# EAGLE design TPS65273V-Board (EAGLE 8.3.2)
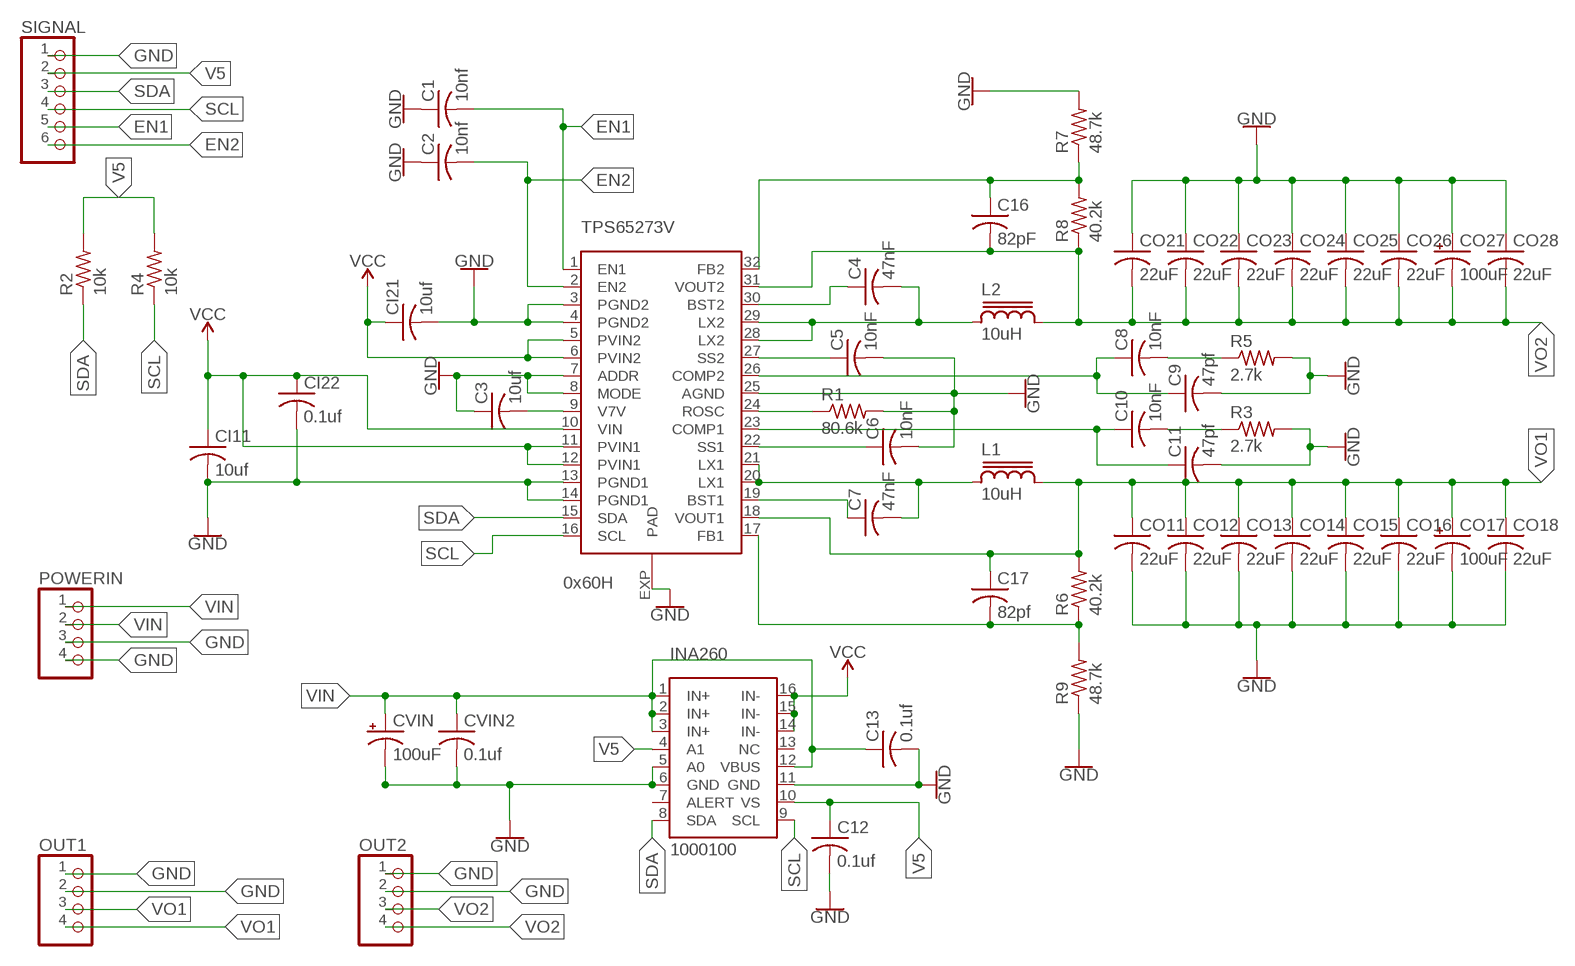
[diagram p0: schematic, sheet 1]

## Parts
C1  10nf  C-USC0805  [C0805]
C2  10nf  C-USC0805  [C0805]
C3  10uf  C-USC0805  [C0805]
C4  47nF  C-USC0805  [C0805]
C5  10nF  C-USC0805  [C0805]
C6  10nF  C-USC0805  [C0805]
C7  47nF  C-USC0805  [C0805]
C8  10nF  C-USC0805  [C0805]
C9  47pf  C-USC0805  [C0805]
C10  10nF  C-USC0805  [C0805]
C11  47pf  C-USC0805  [C0805]
C12  0.1uf  C-USC0805  [C0805]
C13  0.1uf  C-USC0805  [C0805]
C16  82pF  C-USC0805  [C0805]
C17  82pf  C-USC0805  [C0805]
CI11  10uf  C-USC1210  [C1210]
CI21  10uf  C-USC1210  [C1210]
CI22  0.1uf  C-USC0805  [C0805]
CO11  22uF  C-USC0805  [C0805]
CO12  22uF  C-USC0805  [C0805]
CO13  22uF  C-USC0805  [C0805]
CO14  22uF  C-USC0805  [C0805]
CO15  22uF  C-USC0805  [C0805]
CO16  22uF  C-USC0805  [C0805]
CO17  100uF  100UF-POLAR-25V-20%(ELEC)  [PANASONIC_D]
CO18  22uF  C-USC0805  [C0805]
CO21  22uF  C-USC0805  [C0805]
CO22  22uF  C-USC0805  [C0805]
CO23  22uF  C-USC0805  [C0805]
CO24  22uF  C-USC0805  [C0805]
CO25  22uF  C-USC0805  [C0805]
CO26  22uF  C-USC0805  [C0805]
CO27  100uF  100UF-POLAR-25V-20%(ELEC)  [PANASONIC_D]
CO28  22uF  C-USC0805  [C0805]
CVIN  100uF  100UF-POLAR-25V-20%(ELEC)  [PANASONIC_D]
CVIN2  0.1uf  C-USC0805  [C0805]
INA260  1000100  INA260  [TSSOP16]
L1  10uH  MSS1048  [MSS1048]
L2  10uH  MSS1048  [MSS1048]
OUT1  PINHD-1X4  [1X04]
OUT2  PINHD-1X4  [1X04]
POWERIN  PINHD-1X4  [1X04]
R1  80.6k  R-US_R0805  [R0805]
R2  10k  R-US_R0805  [R0805]
R3  2.7k  R-US_R0805  [R0805]
R4  10k  R-US_R0805  [R0805]
R5  2.7k  R-US_R0805  [R0805]
R6  40.2k  R-US_R0805  [R0805]
R7  48.7k  R-US_R0805  [R0805]
R8  40.2k  R-US_R0805  [R0805]
R9  48.7k  R-US_R0805  [R0805]
SIGNAL  PINHD-1X6  [1X06]
TPS65273V  0x60H  TPS65273V  [HTSSOP32DAP]

## Nets
EN1: C1.2 SIGNAL.5 TPS65273V.1(EN1)
EN2: C2.2 SIGNAL.6 TPS65273V.2(EN2)
FB1: C17.2 R6.1 R9.2 TPS65273V.17(FB1)
FB2: C16.1 R7.1 R8.2 TPS65273V.32(FB2)
GND: C1.1 C2.1 C3.1 C5.2 C6.2 C9.2 C11.2 C12.2 C13.2 CI11.2 CI21.2 CI22.2 CO11.2 CO12.2 CO13.2 CO14.2 CO15.2 CO16.2 CO17.- CO18.2 CO21.1 CO22.1 CO23.1 CO24.1 CO25.1 CO26.1 CO27.+ CO28.1 CVIN2.2 CVIN.- INA260.5(A0) INA260.6(GND) INA260.11(GND) OUT1.1 OUT1.2 OUT2.1 OUT2.2 POWERIN.3 POWERIN.4 R1.2 R3.2 R5.2 R7.2 R9.1 SIGNAL.1 TPS65273V.3(PGND2) TPS65273V.4(PGND2) TPS65273V.7(ADDR) TPS65273V.8(MODE) TPS65273V.13(PGND1) TPS65273V.14(PGND1) TPS65273V.25(AGND) TPS65273V.EXP(PAD)
N$1: C3.2 TPS65273V.9(V7V)
N$4: C4.2 L2.1 TPS65273V.28(LX2) TPS65273V.29(LX2)
N$5: C4.1 TPS65273V.30(BST2)
N$7: C10.1 C11.1 TPS65273V.23(COMP1)
N$8: R1.1 TPS65273V.24(ROSC)
N$9: C10.2 R3.1
N$10: C5.1 TPS65273V.27(SS2)
N$11: C8.1 C9.1 TPS65273V.26(COMP2)
N$12: C8.2 R5.1
N$13: C6.1 TPS65273V.22(SS1)
N$14: C7.2 L1.1 TPS65273V.20(LX1) TPS65273V.21(LX1)
N$16: C7.1 TPS65273V.19(BST1)
SCL: INA260.9(SCL) R4.1 SIGNAL.4 TPS65273V.16(SCL)
SDA: INA260.8(SDA) R2.1 SIGNAL.3 TPS65273V.15(SDA)
V5: C12.1 INA260.4(A1) INA260.10(VS) R2.2 R4.2 SIGNAL.2
VCC: CI11.1 CI21.1 CI22.1 INA260.14(IN-) INA260.15(IN-) INA260.16(IN-) TPS65273V.5(PVIN2) TPS65273V.6(PVIN2) TPS65273V.10(VIN) TPS65273V.11(PVIN1) TPS65273V.12(PVIN1)
VIN: C13.1 CVIN2.1 CVIN.+ INA260.1(IN+) INA260.2(IN+) INA260.3(IN+) INA260.12(VBUS) POWERIN.1 POWERIN.2
VO1: C17.1 CO11.1 CO12.1 CO13.1 CO14.1 CO15.1 CO16.1 CO17.+ CO18.1 L1.2 OUT1.3 OUT1.4 R6.2 TPS65273V.18(VOUT1)
VO2: C16.2 CO21.2 CO22.2 CO23.2 CO24.2 CO25.2 CO26.2 CO27.- CO28.2 L2.2 OUT2.3 OUT2.4 R8.1 TPS65273V.31(VOUT2)
Unconnected: INA260.7(ALERT) INA260.13(NC)

## Library data of the parts
C1-C13 C16 C17 CI11 CI21 CI22 CO11-CO16 CO18 CO21-CO26 CO28 CVIN2 = adafruit:C-US: CAPACITOR, American symbol
CO17 CO27 CVIN = SparkFun-Capacitors:100UF-POLAR: 100µF polarized capacitors A capacitor is a passive two-terminal electrical component used to store electrical energy temporarily in an electric field.; PROD_ID: CAP-12547
INA260 = IC-packages_BIG-pack V1.0:INA260
L1 L2 = inductor-coilcraft:MSS1048: SMT Power Inductor
OUT1 OUT2 POWERIN = pinhead:PINHD-1X4: PIN HEADER
R1-R9 = adafruit:R-US_: RESISTOR, American symbol
SIGNAL = pinhead:PINHD-1X6: PIN HEADER
TPS65273V = IC-packages_BIG-pack V1.0:TPS65273V

## Board
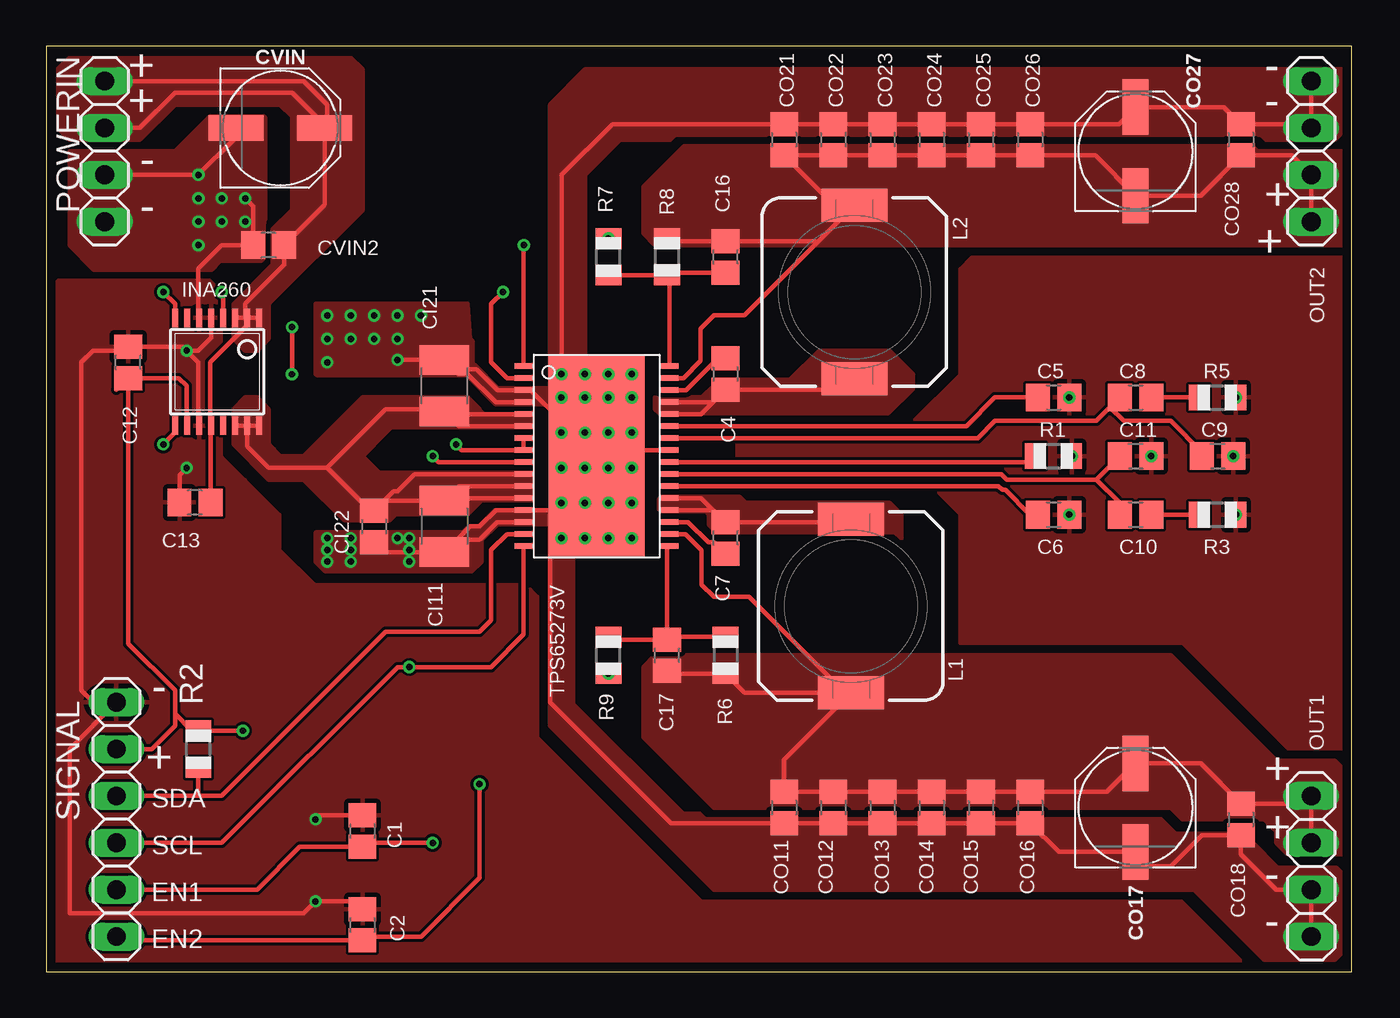
[diagram p1: board, top side]
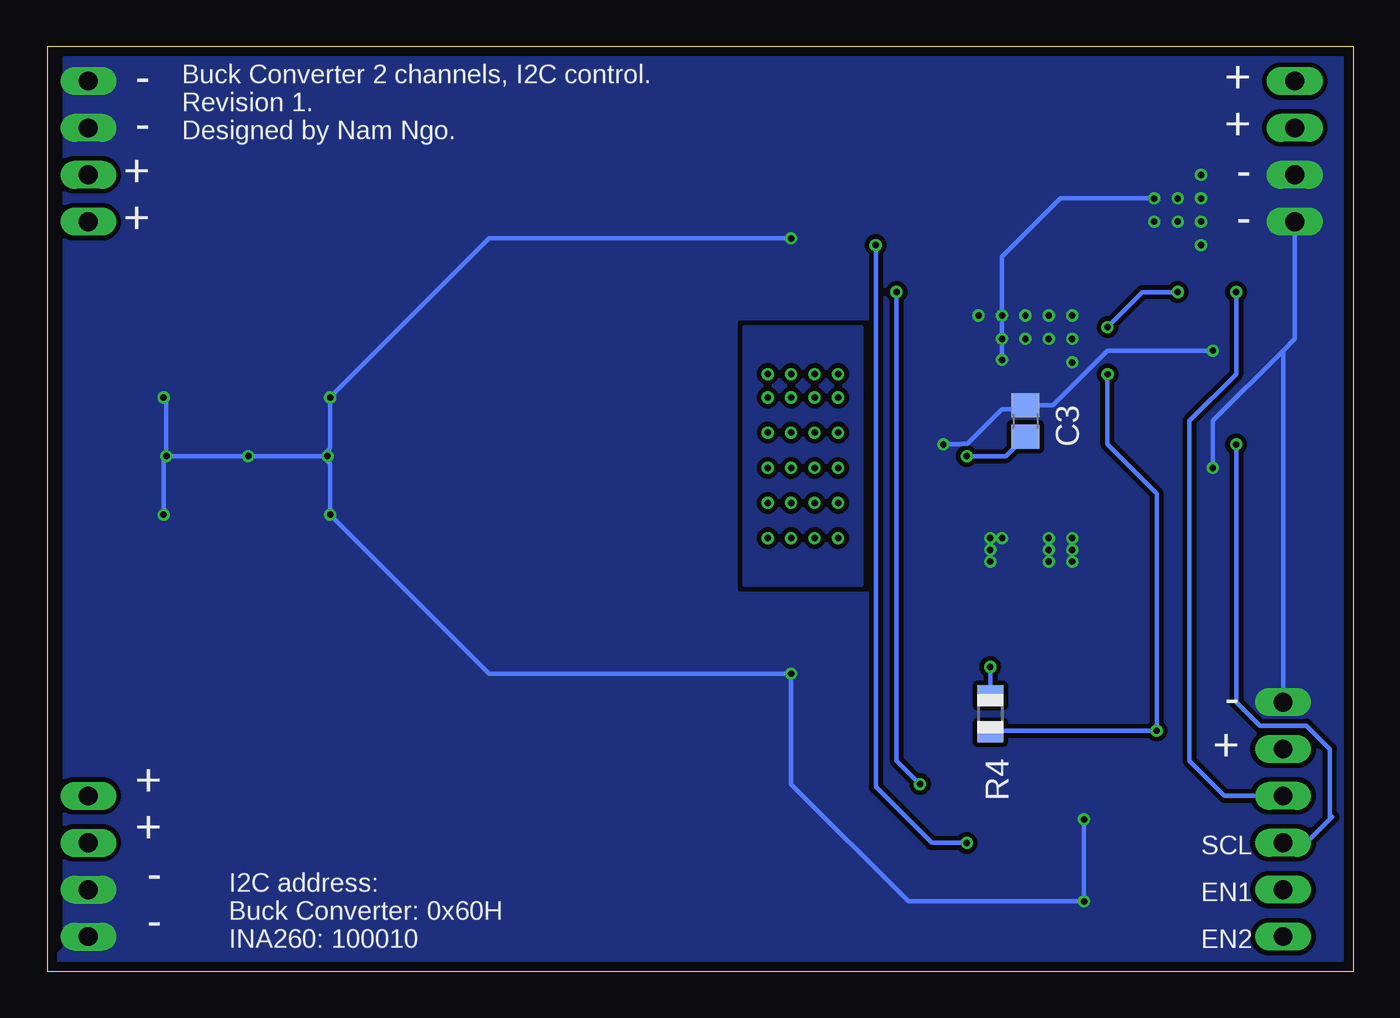
[diagram p2: board, bottom side, seen from below]

Size 70.79 x 50.16 mm. Coordinates in mm from the lower left corner, seen from the top.
Outline: 0,0 70.79,0 70.79,50.16 0,50.16 0,0
Copper layers (1*16): Top 0.035mm / dielectric 1.6mm / Bottom 0.035mm
Design rules "Elecrow_2-layer_PCB_eagle_rule": minimum track width 6mil, minimum drill 12mil, track to track 6mil, track to pad 6mil, pad to pad 6mil, via to via 8mil, smd to smd 0mil, copper to edge 20mil, drill to drill 10mil, minimum pad ring 6mil, minimum via ring 6mil, stop-mask expansion 0mil, vias tented up to drill 100mil, thermal gap 10mil

### Footprints (pad centres in the part's own frame; a part is rotated, then mirrored left to right if it is on the bottom)
C0805 = smd 1.3 x 1.5: 1 -0.85,0; 2 0.85,0
C1210 = smd 1.6 x 2.7: 1 -1.4,0; 2 1.4,0
PANASONIC_D = smd 3 x 1.4: + 2.4,0; - -2.4,0
TSSOP16 = smd 0.305 x 0.991: 1 -2.275,-2.918; 2 -1.625,-2.918; 3 -0.975,-2.918; 4 -0.325,-2.918; 5 0.325,-2.918; 6 0.975,-2.918; 7 1.625,-2.918; 8 2.275,-2.918; 9 2.275,2.918; 10 1.625,2.918; 11 0.975,2.918; 12 0.325,2.918; 13 -0.325,2.918; 14 -0.975,2.918; 15 -1.625,2.918; 16 -2.275,2.918
MSS1048 = smd 3.56 x 1.78: 1 0,4.7; 2 0,-4.7
1X04 = drill 1.016 long: 1 -3.81,0; 2 -1.27,0; 3 1.27,0; 4 3.81,0
R0805 = smd 1.1 x 1.4: 1 -1,0; 2 1,0
1X06 = drill 1.016 long: 1 -6.35,0; 2 -3.81,0; 3 -1.27,0; 4 1.27,0; 5 3.81,0; 6 6.35,0
HTSSOP32DAP = smd 0.3 x 1: 1 -4.875,-3.95; 2 -4.225,-3.95; 3 -3.575,-3.95; 4 -2.925,-3.95; 5 -2.275,-3.95; 6 -1.625,-3.95; 7 -0.975,-3.95; 8 -0.325,-3.95; 9 0.325,-3.95; 10 0.975,-3.95; 11 1.625,-3.95; 12 2.275,-3.95; 13 2.925,-3.95; 14 3.575,-3.95; 15 4.225,-3.95; 16 4.875,-3.95; 17 4.875,3.95; 18 4.225,3.95; 19 3.575,3.95; 20 2.925,3.95; 21 2.275,3.95; 22 1.625,3.95; 23 0.975,3.95; 24 0.325,3.95; 25 -0.325,3.95; 26 -0.975,3.95; 27 -1.625,3.95; 28 -2.275,3.95; 29 -2.925,3.95; 30 -3.575,3.95; 31 -4.225,3.95; 32 -4.875,3.95 | smd 11 x 5.2: EXP 0,0

### Placement (x,y rotation side)
C1  17.14,7.62 270 top
C2  17.14,2.54 270 top
C3  17.78,29.85 270 bottom
C4  36.83,32.39 270 top
C5  54.61,31.11 0 top
C6  54.61,24.76 0 top
C7  36.83,23.49 90 top
C8  59.05,31.11 0 top
C9  63.5,27.94 0 top
C10  59.05,24.76 0 top
C11  59.05,27.94 0 top
C12  4.45,33.02 90 top
C13  8.08,25.43 180 top
C16  36.83,38.73 90 top
C17  33.66,17.14 90 top
CI11  21.59,24.13 270 top
CI21  21.59,31.75 90 top
CI22  17.78,24.13 270 top
CO11  40.01,8.89 270 top
CO12  42.67,8.89 270 top
CO13  45.34,8.89 270 top
CO14  48.01,8.89 270 top
CO15  50.67,8.89 270 top
CO16  53.34,8.89 270 top
CO17  59.05,8.89 90 top
CO18  64.77,8.25 270 top
CO21  40.01,45.09 270 top
CO22  42.67,45.09 270 top
CO23  45.34,45.09 270 top
CO24  48.01,45.09 270 top
CO25  50.67,45.09 270 top
CO26  53.34,45.09 270 top
CO27  59.05,44.45 90 top
CO28  64.77,45.09 270 top
CVIN  12.7,45.72 0 top
CVIN2  12.06,39.37 180 top
INA260  9.27,32.51 180 top
L1  43.62,19.81 0 top
L2  43.81,36.83 180 top
OUT1  68.58,5.72 90 top
OUT2  68.58,44.45 270 top
POWERIN  3.17,44.45 270 top
R1  54.61,27.94 0 top
R2  8.25,12.06 90 top
R3  63.5,24.76 0 top
R4  19.69,13.97 270 bottom
R5  63.5,31.11 0 top
R6  36.83,17.14 270 top
R7  30.48,38.73 90 top
R8  33.66,38.73 270 top
R9  30.48,17.14 90 top
SIGNAL  3.81,8.25 270 top
TPS65273V  29.85,27.94 270 top

### Tracks (layer width: path | path; a pad name or v marks a point on that pad's centre or on a via)
EN1  (via drill 0.35)
  Top 0.254: SIGNAL.5 11.43,4.44 13.75,6.77 C1.2 17.36,6.99 v20.96,6.99 | TPS65273V.1 v25.89,39.37 25.89,39.51
  Bottom 0.254: v25.89,39.37 25.89,10.02 22.86,6.99 v20.96,6.99
EN2  (via drill 0.35)
  Top 0.254: SIGNAL.6 4.03,1.69 C2.2 17.36,1.91 20.32,1.91 23.5,5.08 v23.5,10.16 | TPS65273V.2 24.98,32.16 24.13,33.02 24.13,36.2 v24.77,36.83
  Bottom 0.254: v24.77,36.83 24.77,11.43 v23.5,10.16
FB1
  Top 0.254: R6.1 33.8,18.14 C17.2 | C17.2 30.63,17.99 R9.2 | C17.2 33.66,22.93 TPS65273V.17
FB2
  Top 0.254: C16.1 33.8,37.89 R8.2 | R8.2 R7.1 | TPS65273V.32 33.8,37.6 R8.2
GND  (via drill 0.35)
  Top 0.152: TPS65273V.EXP 29.85,24.13 | 29.85,24.13 v30.48,23.49 | TPS65273V.EXP 29.85,24.13 | 29.85,24.13 v29.21,23.49 | TPS65273V.EXP 29.85,25.4 | 29.85,25.4 v27.94,23.49 | TPS65273V.EXP 29.85,27.45 27.87,25.47 | TPS65273V.EXP 29.85,26.04 | 29.85,26.04 v29.21,25.4 | TPS65273V.EXP 29.85,26.04 | 29.85,26.04 v30.48,25.4 | TPS65273V.EXP 29.85,27.3 | 29.85,27.3 v31.75,25.4 | TPS65273V.EXP 31.12,27.94 v31.75,27.3 | TPS65273V.EXP v30.48,27.3 | TPS65273V.EXP v29.21,27.3 | TPS65273V.EXP 28.58,27.94 v27.94,27.3 | TPS65273V.EXP 29.21,27.94 v27.94,29.21 | TPS65273V.EXP 29.85,28.57 | 29.85,28.57 v29.21,29.21 | TPS65273V.EXP 29.85,28.57 | 29.85,28.57 v30.48,29.21 | TPS65273V.EXP 30.48,27.94 v31.75,29.21 | TPS65273V.EXP 29.85,29.21 | 29.85,29.21 v31.75,31.11 | TPS65273V.EXP 29.85,30.48 | 29.85,30.48 v30.48,31.11 | TPS65273V.EXP 29.85,30.48 | 29.85,30.48 v29.21,31.11 | TPS65273V.EXP 29.85,29.21 | 29.85,29.21 v27.94,31.11 | TPS65273V.EXP 29.85,30.48 | 29.85,30.48 v27.94,32.39 | TPS65273V.EXP 29.85,31.75 | 29.85,31.75 v29.21,32.39 | TPS65273V.EXP 29.85,31.75 | 29.85,31.75 v30.48,32.39 | TPS65273V.EXP 29.85,30.48 | 29.85,30.48 v31.75,32.39 | TPS65273V.EXP 29.85,27.3 | 29.85,27.3 v27.94,25.4 | TPS65273V.EXP 29.85,25.4 | 29.85,25.4 v31.75,23.49
  Top 0.254: v7.62,33.66 7.41,33.87 C12.2 4.23,33.66 2.54,33.66 1.91,33.02 1.91,15.24 2.54,14.61 SIGNAL.1 1.27,12.06 1.27,3.17 13.97,3.17 v14.6,3.81 16.73,3.81 C2.1 | v7.62,33.66 8.25,33.02 8.25,29.64 INA260.11 | TPS65273V.4 24.38,30.86 22.86,32.39 22.36,32.39 22.1,32.64 | 22.1,32.64 23.34,32.64 24.47,31.51 TPS65273V.3 26.27,31.51 27.94,29.85 | 22.1,32.64 CI21.2 v19.05,33.15 | 22.28,23.42 22.99,24.13 23.5,24.13 24.38,25.01 TPS65273V.13 27.28,25.01 29.64,27.38 | TPS65273V.14 24.44,24.36 23.5,23.42 22.28,23.42 | 22.28,23.42 CI11.2 18.33,22.73 CI22.2 | POWERIN.3 v8.25,43.18 10.16,45.09 10.16,45.58 CVIN.- | 8.25,35.56 8.25,38.1 9.53,39.37 CVIN2.2 11.21,41.49 v10.79,41.91 | 8.25,35.56 8.25,35.47 INA260.6 8.25,35.56 | C1.1 14.82,8.47 v14.6,8.25 | TPS65273V.7 TPS65273V.8 22.54,28.26 v22.23,28.57 | C13.2 7.23,26.91 v7.62,27.3 | v7.62,33.66 8.25,33.66 8.95,34.35 INA260.5 8.89,35.56 | TPS65273V.EXP 29.85,28.26 33.66,28.26 TPS65273V.25 | 29.57,27.18 28.58,24.45 | 29.64,27.38 29.57,27.18 | 29.64,27.38 TPS65273V.EXP | OUT1.1 OUT1.2 66.67,4.44 64.77,6.35 CO18.2 62.65,7.41 60.96,5.72 59.83,5.72 CO17.- 54.89,6.49 CO16.2 CO15.2 CO14.2 CO13.2 CO12.2 CO11.2 33.87,8.04 27.3,14.61 27.3,24.91 27.87,25.47 29.57,27.18 | OUT2.1 OUT2.2 68.36,45.94 CO28.1 63.86,46.85 CO27.+ 58.14,45.94 CO26.1 CO25.1 CO24.1 CO23.1 CO22.1 CO21.1 30.7,45.94 27.94,43.18 v27.94,32.39 v27.94,31.11 27.94,29.85 | TPS65273V.EXP 27.94,29.85
  Bottom 0.152: 18,30.48 C3.1
  Bottom 0.254: v14.6,8.25 v14.6,3.81 24.13,3.81 30.48,10.16 R9.1 46.84,16.14 C6.2 55.46,27.52 55.88,27.94 | 18,30.48 19.05,30.48 20.93,28.6 21.23,28.6 21.25,28.57 v22.23,28.57 | C3.1 16.3,30.69 13.33,33.66 v7.62,33.66 | v7.62,27.3 7.62,29.85 3.81,33.66 | POWERIN.4 3.17,34.29 3.81,33.66 | 55.88,27.94 55.46,28.36 C5.2 46.84,39.73 R7.2 | 55.88,27.94 R1.2 C11.2 C9.2 | R3.2 64.5,27.79 C9.2 | C9.2 64.35,30.96 R5.2 | v10.79,41.91 15.88,41.91 19.05,38.73 v19.05,33.15 | SIGNAL.1 3.81,33.66
  other vias: 55.46,31.11 55.61,27.94 55.46,24.76 59.91,27.94 64.35,27.94 64.5,31.11 64.5,24.76 30.48,16.14 30.48,39.73 15.24,23.49 16.51,23.49 15.24,22.86 16.51,22.86 15.24,22.22 16.51,22.22 19.69,22.22 19.69,22.86 19.69,23.49 19.05,23.49 16.51,34.29 19.05,34.29 20.32,35.56 17.78,35.56 15.24,35.56 15.24,34.29 16.51,35.56 17.78,34.29 19.05,35.56 15.24,33.02 8.25,41.91 8.25,40.64 9.53,40.64 9.53,41.91 10.79,40.64 8.25,39.37
  pour Top (isolate 0.254, rank 4, no thermals): 14.6,36.2 22.86,36.2 22.99,34.29 23.11,34.16 23.11,32.92 23.09,32.89 23.22,32.89 24.49,31.62 28.45,31.62 28.58,31.75 28.58,30.71 28.63,30.66 28.35,30.66 28.24,30.76 24.36,30.76 22.81,32.31 14.68,32.31 14.6,32.39
  pour Top (isolate 0.254, rank 4, no thermals): 14.6,22.22 14.6,23.77 14.63,23.8 22.61,23.8 22.94,24.13 23.47,24.13 24.33,24.99 28.5,24.99 28.58,24.92 28.58,24.28 28.6,24.26 24.46,24.26 23.6,23.39 23.6,22.22 23.06,21.69 15.14,21.69
  pour Top (isolate 0.254, rank 4, no thermals): 1.27,44.45 6.99,44.45 8.89,46.36 11.79,46.36 11.86,46.28 11.86,40.77 11.81,40.72 11.81,38.68 11.66,38.53 9.45,38.53 8.97,38.05 2.59,38.05 1.27,39.37
  pour Top (isolate 0.406, rank 4, no thermals): 27.3,31.75 27.3,46.99 29.21,48.9 70.48,48.9 70.48,45.72 69.85,45.09 31.12,45.09 29.21,43.18 29.21,31.75
  pour Top (isolate 0.406, rank 4, no thermals): 28.58,23.49 28.58,14.5 34.52,8.56 60.12,8.56 61.21,7.47 65.25,7.47 65.41,7.62 65.41,6.99 66.75,5.64 69.93,5.64 70.48,5.08 70.48,1.27 69.85,0.64 66.04,0.64 62.23,4.44 36.2,4.44 27.3,13.33 27.3,23.49
  pour Bottom (isolate 0.254, rank 3, no thermals): 0.64,49.53 69.85,49.53 69.85,1.27 70.48,0.64 0.64,0.64
  pour Top: 64.77,0 64.77,0.64 61.59,3.81 35.56,3.81 26.67,12.7 26.67,20.32 26.04,20.95 14.6,20.95 12.7,22.86 12.7,24.76 10.79,26.67 9.53,27.94 9.53,36.83 8.89,37.47 0.64,37.47 0,36.83 0,0
  pour Top: 70.48,12.06 67.31,12.06 61.59,17.78 49.53,17.78 49.53,24.76 48.26,26.04 38.1,26.04 37.47,26.67 37.47,29.21 38.1,29.85 46.99,29.85 49.53,32.39 49.53,38.1 50.16,38.73 70.48,38.73
N$1  (via drill 0.35)
  Top 0.254: v20.96,27.94 21.28,27.61 TPS65273V.9
  Bottom 0.254: v20.96,27.94 18.84,27.94 C3.2
N$2
  pour Bottom (isolate 0.254, rank 2, no thermals): 26.67,34.93 33.02,34.93 33.02,20.95 26.67,20.95
N$4
  Top 0.254: TPS65273V.28 35.51,30.21 C4.2 | C4.2 43.22,31.54 L2.1 | TPS65273V.29 36.16,30.86 C4.2
  pour Top (isolate 0.254, rank 2, no thermals): 33.02,31.11 35.56,31.11 36.2,31.75 36.2,31.83 36.45,32.08 40.34,32.08 41.91,33.66 45.72,33.66 46.99,32.39 46.99,31.6 45.64,30.25 33.25,30.25 33.02,30.48
N$5
  Top 0.254: C4.1 36.41,33.23 34.69,31.51 TPS65273V.30
N$7
  Top 0.254: TPS65273V.23 51.77,26.96 52.07,26.67 56.94,26.67 | 56.94,26.67 C11.1 | C10.1 58.2,25.4 56.94,26.67
N$8
  Top 0.254: TPS65273V.24 53.29,27.61 R1.1
N$9
  Top 0.254: R3.1 C10.2
N$10
  Top 0.254: TPS65273V.27 49.88,29.57 51.44,31.11 C5.1
N$11
  Top 0.254: TPS65273V.26 50.51,28.91 51.44,29.85 56.94,29.85 57.68,30.59 | 57.68,30.59 C8.1 | C9.1 62.65,28.15 60.96,29.85 58.42,29.85 57.68,30.59
N$12
  Top 0.254: R5.1 C8.2
N$13
  Top 0.254: TPS65273V.22 51.63,26.32 51.84,26.11 51.99,26.11 53.34,24.76 C6.1
N$14
  Top 0.254: TPS65273V.20 36.16,25.01 C7.2 | TPS65273V.21 35.51,25.66 C7.2 | C7.2 43.46,24.34 L1.1
  pour Top (isolate 0.254, rank 2, no thermals): 46.36,23.49 46.36,24.76 45.72,25.4 37.92,25.4 37.59,25.73 33.35,25.73 33.22,25.6 33.22,25.07 33.35,24.94 35.76,24.94 35.94,24.76 35.94,24.21 36.32,23.83 46.02,23.83
N$16
  Top 0.254: C7.1 36.21,23.26 35.9,23.26 34.8,24.36 TPS65273V.19
SCL  (via drill 0.35)
  Top 0.254: TPS65273V.16 25.89,18.27 24.13,16.51 v19.69,16.51 19.05,16.51 9.53,6.99 SIGNAL.4 | INA260.9 7,29.22 v6.35,28.57
  Bottom 0.254: SIGNAL.4 2.54,6.99 1.27,8.25 | 1.14,8.38 1.27,8.25 | v19.69,16.51 R4.1 | v6.35,28.57 6.35,14.61 5.08,13.33 2.54,13.33 1.27,12.06 1.27,8.25
SDA  (via drill 0.35)
  Top 0.254: TPS65273V.15 24.98,23.71 24.13,22.86 24.13,19.05 23.5,18.41 18.42,18.41 9.53,9.52 8.25,9.52 | 8.25,9.52 SIGNAL.3 | INA260.8 7,36.18 v6.35,36.83 | R2.1 8.25,9.52
  Bottom 0.254: v6.35,36.83 6.35,32.39 8.89,29.85 8.89,11.43 6.99,9.52 SIGNAL.3 5.08,9.52
V5  (via drill 0.35)
  Top 0.254: C12.1 7.2,32.17 7.62,31.75 7.62,29.62 INA260.10 | 3.81,31.54 C12.1 | C12.1 4.45,17.78 6.99,15.24 6.99,13.97 | 6.99,13.97 6.99,13.33 5.71,12.06 SIGNAL.2 | 6.99,13.97 7.89,13.06 R2.2 v10.66,13.06 v10.67,13.06 | INA260.4 9.6,36.76 v9.53,36.83 | v13.33,34.93 v13.33,32.39 v13.32,32.38
  Bottom 0.254: SIGNAL.2 3.17,12.06 | R4.2 19.6,13.06 v10.67,13.06 10.67,25.91 13.33,28.57 13.33,32.37 v13.32,32.38 | v9.53,36.83 11.43,36.83 v13.33,34.93
VCC
  Top 0.254: INA260.14 INA260.15 | INA260.15 INA260.16 | TPS65273V.12 21.73,25.66 CI11.1 | TPS65273V.11 22.38,26.32 CI11.1 | TPS65273V.6 22.38,29.57 21.84,30.1 | 21.84,30.1 CI21.1 21.46,30.48 18.42,30.48 15.24,27.3 | TPS65273V.5 21.96,30.21 21.84,30.1 | TPS65273V.10 19.98,26.96 19.05,26.04 18.84,26.04 CI22.1 | CI11.1 18.33,25.53 CI22.1 | INA260.15 10.9,28.47 12.06,27.3 15.24,27.3 | CI22.1 17.57,24.98 15.24,27.3
  pour Top (isolate 0.254, rank 3, no thermals): 10.16,28.57 10.16,30.48 10.79,31.11 11.43,31.11 12.06,30.48 12.06,28.57 12.7,27.94 15.24,27.94 15.24,26.67 12.06,26.67
  pour Top (rank 3, no thermals): 13.97,27.94 17.14,31.11 22.86,31.11 23.5,30.48 23.5,30.43 23.72,30.2 26.31,30.2 26.31,29.51 26.29,29.49 18.69,29.49 18.42,29.21 17.14,27.94 18.06,27.03 26.31,27.03 26.37,26.97 26.37,25.55 23.6,25.55 22.83,24.79 18.95,24.79 18.62,24.46 16.18,24.46 13.97,26.67
VIN
  Top 0.254: INA260.2 INA260.1 | INA260.2 INA260.3 | INA260.2 10.9,35.03 8.89,33.02 8.89,29.65 INA260.12 8.93,29.57 C13.1 | POWERIN.1 13.97,48.26 15.24,46.99 15.24,45.86 15.17,45.79 | 15.17,45.79 CVIN.+ 15.1,41.55 CVIN2.1 12.91,38.32 10.79,36.2 10.79,35.53 INA260.2 | POWERIN.2 5.08,45.72 6.99,47.62 13.33,47.62 15.17,45.79
  pour Top (isolate 0.254, rank 3, no thermals): 1.27,45.09 5.08,45.09 6.99,46.99 12.7,46.99 13.33,46.36 13.33,45.09 13.97,44.45 16.51,44.45 17.14,45.09 17.14,48.9 16.51,49.53 1.27,49.53 0.64,48.9 0.64,45.72
  pour Top (isolate 0.254, no thermals): 10.16,34.29 10.16,36.17 12.29,38.3 12.29,40.23 13.33,41.28 13.33,45.09 17.14,45.09 17.14,41.28 12.06,36.2 12.06,34.29 11.43,33.66 10.79,33.66
VO1
  Top 0.254: OUT1.3 OUT1.4 68.16,9.11 CO18.1 62.59,11.29 CO17.+ 57.51,9.74 CO16.1 CO15.1 CO14.1 CO13.1 CO12.1 CO11.1 40.01,11.49 43.47,14.95 | 43.47,14.95 L1.2 37.86,15.11 R6.2 33.8,16.14 C17.1 | TPS65273V.18 34.66,23.71 35.54,22.84 35.54,20.98 36.2,20.32 38.1,20.32 43.47,14.95
  pour Top (isolate 0.254, rank 3, no thermals): 70.48,6.35 67.31,6.35 66.67,6.99 66.67,7.62 66.04,8.25 61.59,8.25 60.96,8.89 36.2,8.89 32.38,12.7 32.38,16.51 33.02,17.14 60.96,17.14 66.67,11.43 69.85,11.43 70.48,10.79
VO2
  Top 0.254: OUT2.4 OUT2.3 67.53,44.23 CO28.2 62.59,42.05 CO27.- 56.87,44.23 CO26.2 CO25.2 CO24.2 CO23.2 CO22.2 CO21.2 42.71,41.53 L2.2 41.78,39.5 | TPS65273V.31 34.55,32.16 35.48,33.1 35.48,34.85 36.2,35.56 37.84,35.56 41.78,39.5 | 41.78,39.5 41.7,39.59 C16.2 33.8,39.59 R8.1
  pour Top (isolate 0.254, no thermals): 70.48,39.37 70.48,44.45 65.66,44.45 65.38,44.73 34.57,44.73 32.38,42.55 32.38,40.01 33.02,39.37

### Text on the board
tNames: + | - | + | - | - | + | - | + | - | + | + | SDA | + | SCL | - | EN1 | - | EN2
bNames: + | - | + | Buck Converter 2 channels, I2C control. / Revision 1. / Designed by Nam Ngo. | - | - | + | - | + | - | + | + | + | SCL | - | EN1 | - | EN2 | I2C address: / Buck Converter: 0x60H / INA260: 100010